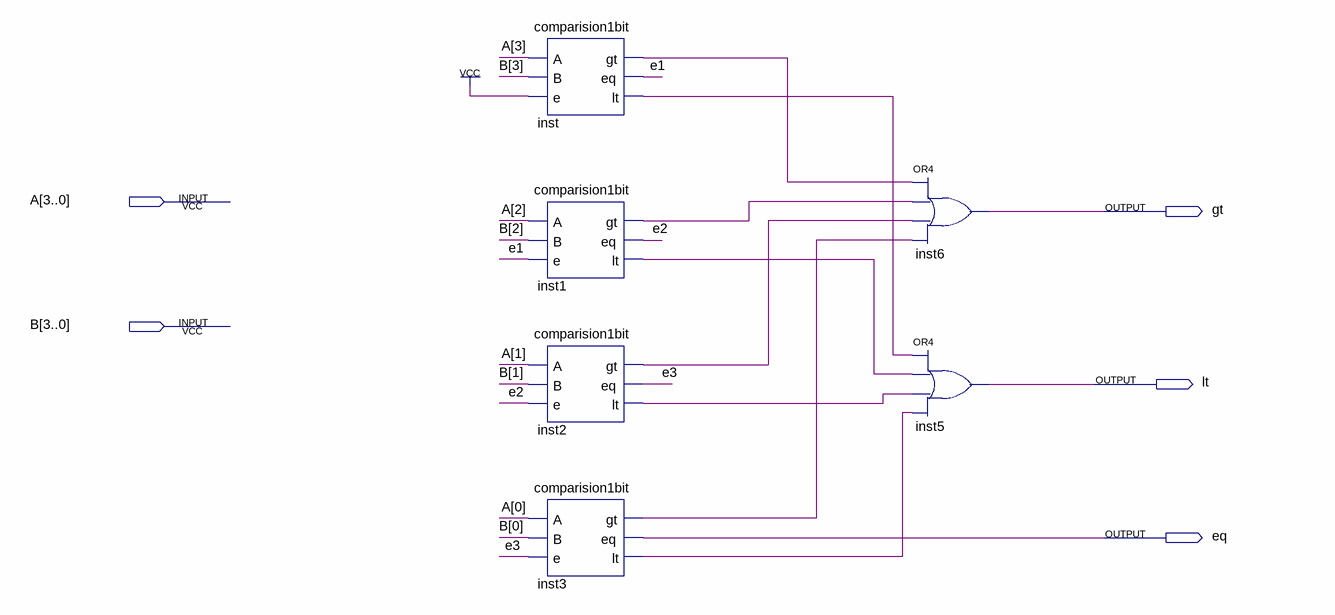
[diagram p0: schematic sheet]
// Quartus schematic comparision4bit.bdf as structural Verilog: 6 symbols, 5 pins
module comparision4bit (
  input  [3:0] A,
  input  [3:0] B,
  output gt,
  output lt,
  output eq
);

  wire e1, e2, e3, inst1_gt, inst1_lt, inst2_gt, inst2_lt, inst3_gt, inst3_lt, inst_gt, inst_lt;

  comparision1bit inst (.A(A[3]), .B(B[3]), .e(1'b1), .gt(inst_gt), .eq(e1), .lt(inst_lt));
  comparision1bit inst1 (.A(A[2]), .B(B[2]), .e(e1), .gt(inst1_gt), .eq(e2), .lt(inst1_lt));
  comparision1bit inst2 (.A(A[1]), .B(B[1]), .e(e2), .gt(inst2_gt), .eq(e3), .lt(inst2_lt));
  comparision1bit inst3 (.A(A[0]), .B(B[0]), .e(e3), .gt(inst3_gt), .eq(eq), .lt(inst3_lt));
  or inst6 (gt, inst_gt, inst1_gt, inst2_gt, inst3_gt);
  or inst5 (lt, inst_lt, inst1_lt, inst2_lt, inst3_lt);
endmodule
